# EasyEDA Pro project ProPrj_SmartOvi v1_2025-12-15.epro

# Schematic SmartOvi Circuit
Board Name: Board1; Create Date: 2023-03-04; Page Name: P1; Project Name: SmartOvi v1; Schematic Name: SmartOvi Circuit; Update Date: 2024-11-25; Company: EasyEDA.com; Drawed: EasyEDA Pro; Page Size: A4; Part Number: JLCPCB-002; Reviewed: EasyEDA Pro; Version: V0.1
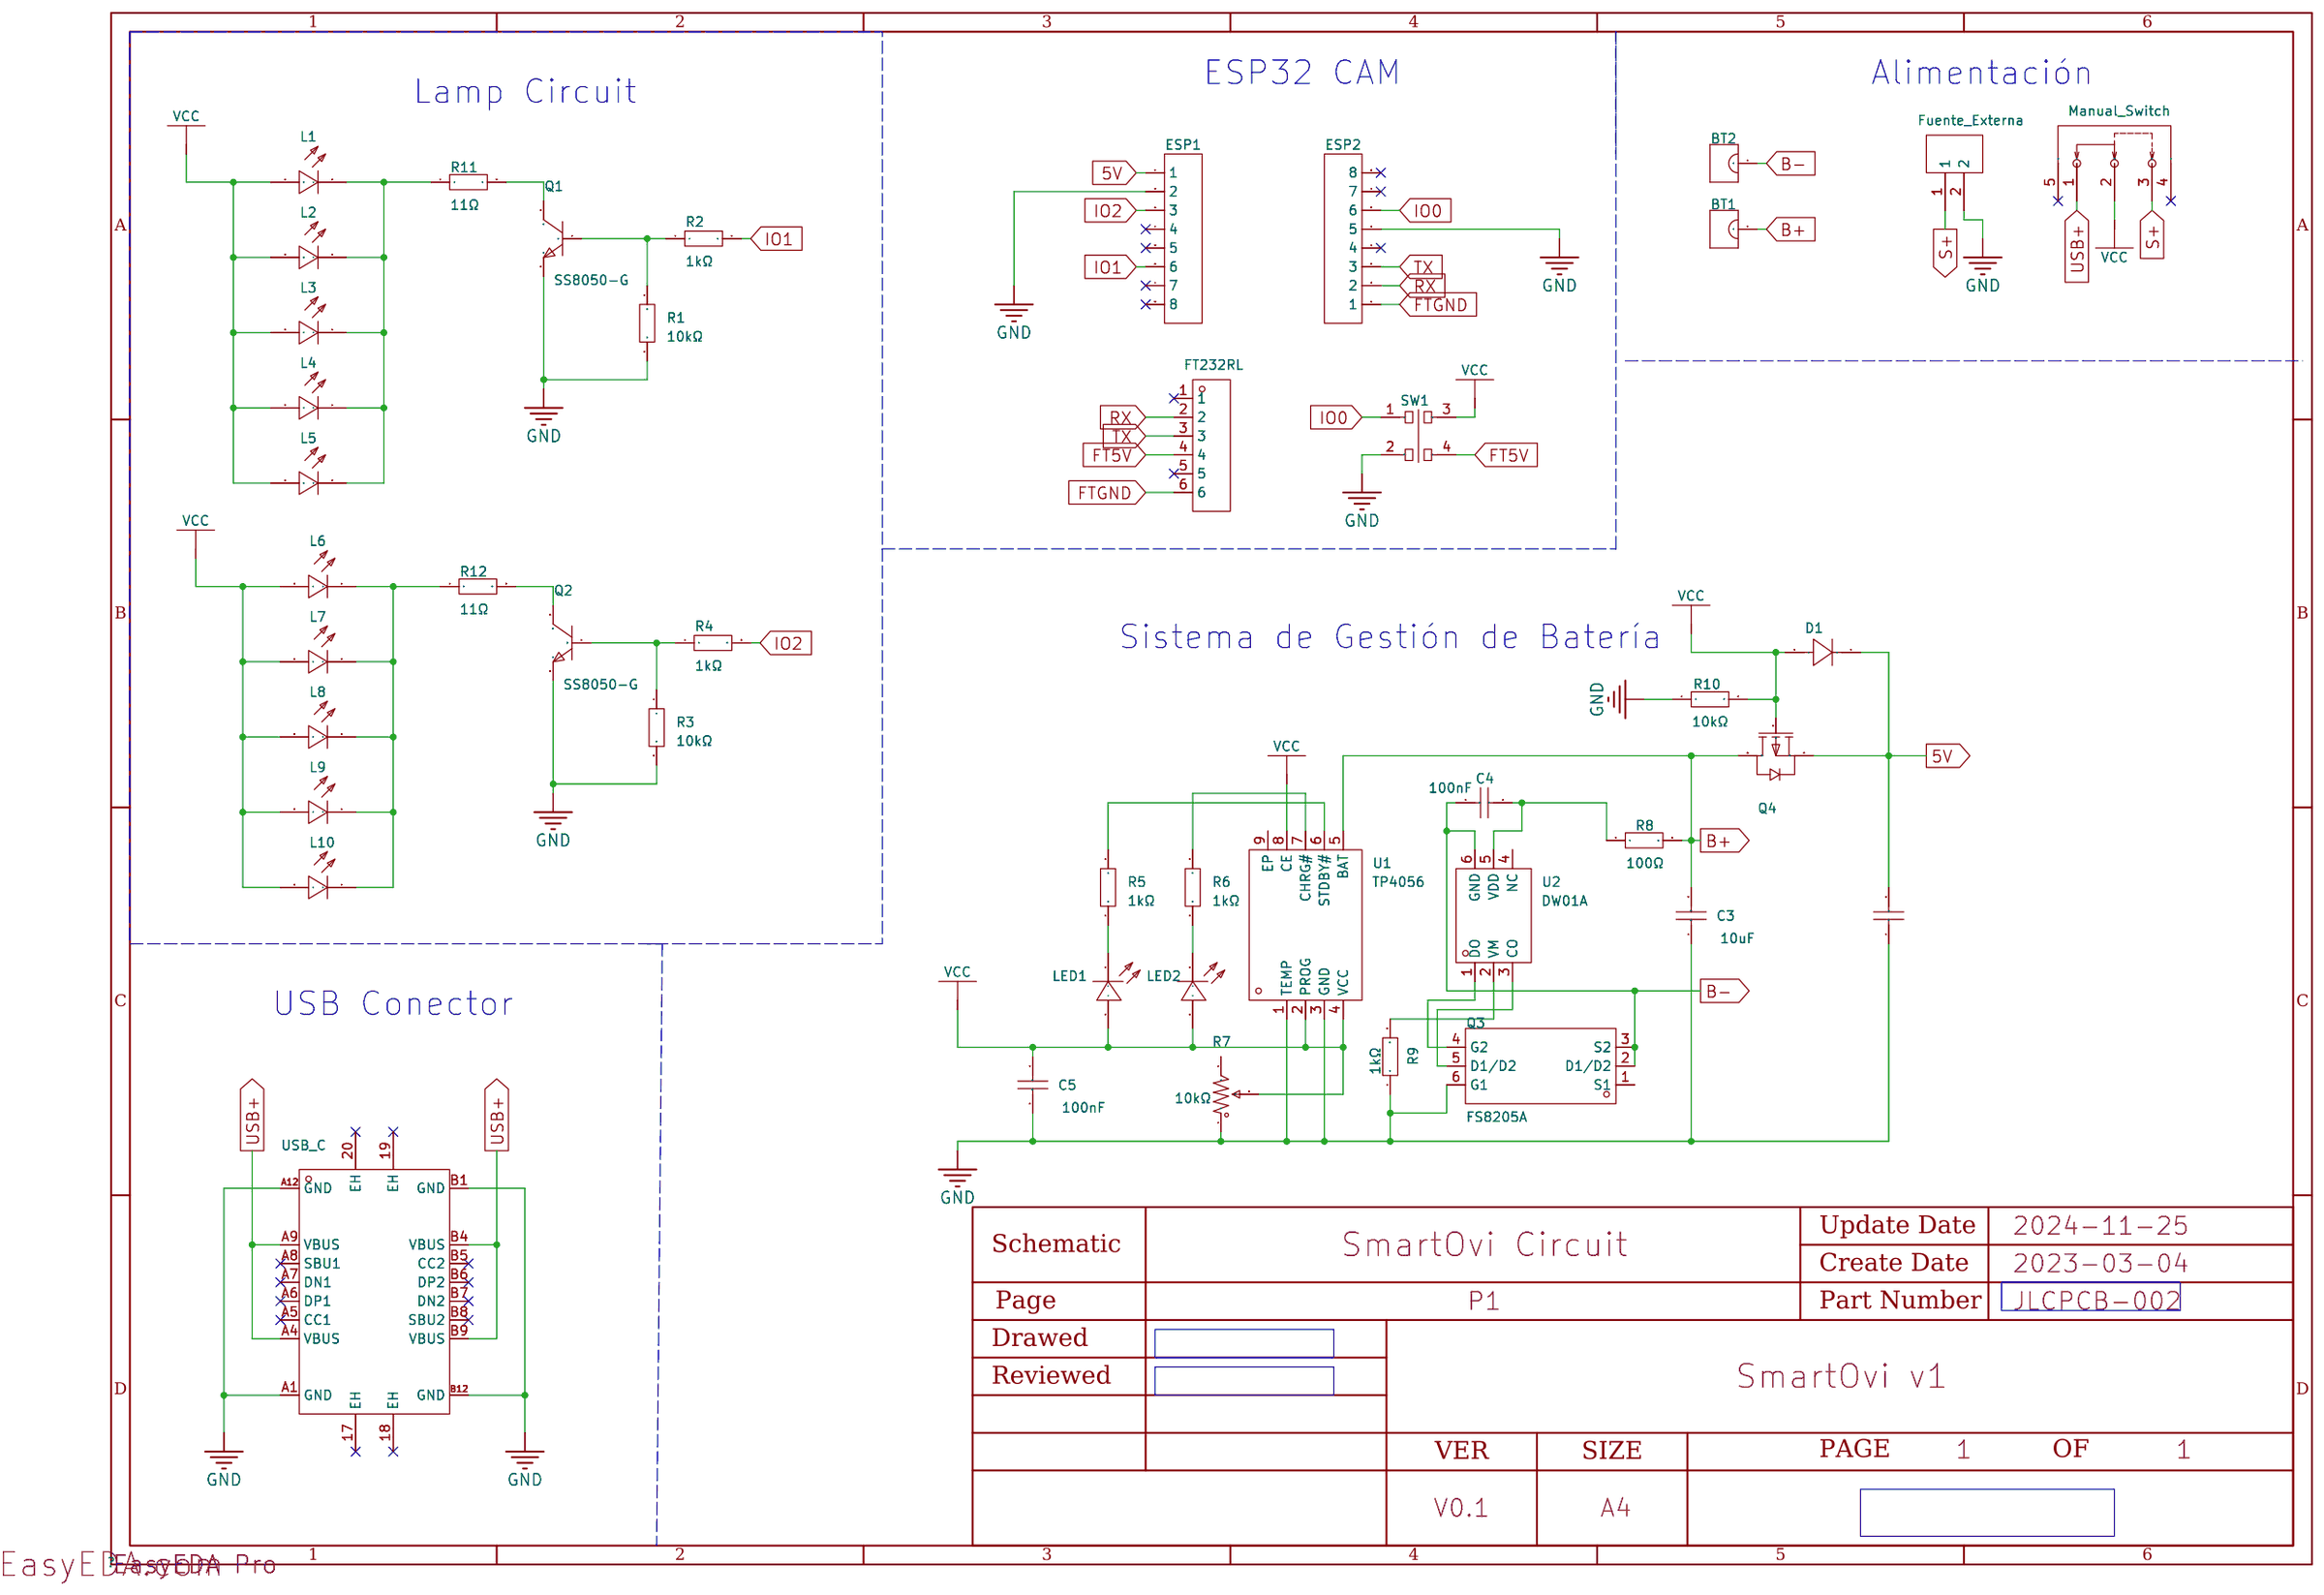
[diagram p0: schematic sheet]

## Parts
BT1  MY-18650-01  [BAT-TH_MY-18650-01]
BT2  MY-18650-01  [BAT-TH_MY-18650-01]
C1  10uF  [C0805]
C3  10uF  [C0805]
C4  100nF  [C0805]
C5  100nF  [C0805]
D1  VS-90EPS16L-M3  [TO-247AD-2_L16.0-W5.0-P10.92-L]
ESP1  2.54-1*8P母环保  [HDR-TH_8P-P2.54-V-F-1]
ESP2  2.54-1*8P母环保  [HDR-TH_8P-P2.54-V-F-1]
FT232RL  2.54-1*6P母  [HDR-TH_6P-P2.54-V-F]
Fuente_Externa  WJ500V-5.08-2P  [CONN-TH_2P-P5.00_WJ500V-5.08-2P]
L1  MHL5013UGDWT  [LED-TH_BD5.8-P2.54-RD]
L2  MHL5013UGDWT  [LED-TH_BD5.8-P2.54-RD]
L3  MHL5013UGDWT  [LED-TH_BD5.8-P2.54-RD]
L4  MHL5013UGDWT  [LED-TH_BD5.8-P2.54-RD]
L5  MHL5013UGDWT  [LED-TH_BD5.8-P2.54-RD]
L6  MHL5013UGDWT  [LED-TH_BD5.8-P2.54-RD]
L7  MHL5013UGDWT  [LED-TH_BD5.8-P2.54-RD]
L8  MHL5013UGDWT  [LED-TH_BD5.8-P2.54-RD]
L9  MHL5013UGDWT  [LED-TH_BD5.8-P2.54-RD]
L10  MHL5013UGDWT  [LED-TH_BD5.8-P2.54-RD]
LED1  NCD0805R1  [LED0805-RD]
LED2  NCD0805B2  [LED0805-RD]
Manual_Switch  SK12D07VG4  [SW-TH_SK12D07VG4]
Q1  SS8050-G  [SOT-23-3_L2.9-W1.6-P1.90-LS2.8-BR]
Q2  SS8050-G  [SOT-23-3_L2.9-W1.6-P1.90-LS2.8-BR]
Q3  FS8205A  [SOT-23-6_L2.9-W1.6-P0.95-LS2.8-BR]
Q4  AO3401A  [SOT-23_L2.9-W1.3-P1.90-LS2.4-BR]
R1  10kΩ  [R0805]
R2  1kΩ  [R0805]
R3  10kΩ  [R0805]
R4  1kΩ  [R0805]
R5  1kΩ  [R0805]
R6  1kΩ  [R0805]
R7  10kΩ  [RES-ADJ-SMD_3P-L3.0-W3.8-P1.75-BR]
R8  100Ω  [R0805]
R9  1kΩ  [R0805]
R10  10kΩ  [R0805]
R11  11Ω  [R0805]
R12  11Ω  [R0805]
SW1  BTSA-L-P-11  [SW-TH_BTSA-X-P-11]
U1  TP4056  [ESOP-8_L4.9-W3.9-P1.27-LS6.0-BL-EP]
U2  DW01A  [SOT-23-6_L2.9-W1.6-P0.95-LS2.8-BL]
USB_C  TYPEC-306DDW-ARP16  [USB-C-TH_TYPEC-306DDW-ARP16]

## Library data of the parts
BT1 BT2 = MY-18650-01: LCSC Part Name: 18650电池夹; Supplier Part: C2979183; Manufacturer: MYOUNG(美阳); Supplier Footprint: 插件; JLCPCB Part Class: Extended Part; Datasheet: https://atta.szlcsc.com/upload/public/pdf/source/20220302/9B78703FC9BDD52215F97855EB9B4A89.pdf; Supplier: LCSC
C1 C3 = CL21A106KPFNNNE: Capacitance: Tolerance:±10% Tolerance:±10% Voltage Rated: Temperature Coefficient:; LCSC Part Name: 10uF ±10% 10V; Supplier Part: C17024; Manufacturer: SAMSUNG(三星); Supplier Footprint: 0805; JLCPCB Part Class: Extended Part; Datasheet: https://atta.szlcsc.com/upload/public/pdf/source/20160103/1457707691379.pdf; Supplier: LCSC; Tolerance: ±10%
C4 C5 = 0805B104K500NT: Capacitance: Tolerance:±10% Tolerance:±10% Voltage Rated: Temperature Coefficient:; LCSC Part Name: 100nF ±10% 50V; Supplier Part: C38141; Manufacturer: FH(风华); Supplier Footprint: 0805; JLCPCB Part Class: Extended Part; Datasheet: https://atta.szlcsc.com/upload/public/pdf/source/20170923/C38141_1506149447419988747.pdf; Supplier: LCSC; Tolerance: ±10%
D1 = VS-90EPS16L-M3: Supplier Part: C468140; Manufacturer: VISHAY(威世); Supplier Footprint: TO-247AD-2L; JLCPCB Part Class: Extended Part; Datasheet: https://atta.szlcsc.com/upload/public/pdf/source/20241025/B94B8A9F71F9BBF4830FCA7478373A93.pdf; Supplier: LCSC
ESP1 ESP2 = 2.54-1*8P母环保: Number of Rows:单排 Number of Holes:8 Pitch:2.54mm Holes Structure:1x8P Row Spacing:- Mounting Type:Straight Insulation Height:- Contact Material:- Contact Plating:-; LCSC Part Name: 2.54mm 1x8P; Supplier Part: C27438; Manufacturer: BOOMELE(博穆精密); Supplier Footprint: 插件,P=2.54mm; JLCPCB Part Class: Extended Part; Datasheet: https://atta.szlcsc.com/upload/public/pdf/source/20151109/1457707554453.pdf; Supplier: LCSC; Number of Rows: 单排; Number of Holes: 8; Pitch: 2.54mm; Holes Structure: 1x8P; Mounting Type: Straight
FT232RL = 2.54-1*6P母: Number of Rows:单排 Number of Holes:6 Pitch:2.54mm Holes Structure:1x6P Row Spacing:- Mounting Type:Straight Insulation Height:- Contact Material:- Contact Plating:-; LCSC Part Name: 2.54mm 1x6P; Supplier Part: C40877; Manufacturer: BOOMELE(博穆精密); Supplier Footprint: 直插,P=2.54mm; JLCPCB Part Class: Extended Part; Datasheet: https://atta.szlcsc.com/upload/public/pdf/source/20151109/1457707559772.pdf; Supplier: LCSC; Number of Rows: 单排; Number of Holes: 6; Pitch: 2.54mm; Holes Structure: 1x6P; Mounting Type: Straight
Fuente_Externa = WJ500V-5.08-2P: Pitch:5.08mm Number of Rows:1 Number of PINs Per Row:2 Mounting Style:直针 Current Rating (Max):18A Voltage Rating (Max):250V Wire Gauge - AWG:14~30 Wire Gauge - mm?:2.5 Operating Temperature Range:-40℃~+105℃ Operating Temperature Range:-40℃~+105℃ Color:Gre; LCSC Part Name: 5.08mm 排数:1 每排P数:2 直针 可拼接; Supplier Part: C8465; Manufacturer: KANGNEX(康奈克斯电气); Supplier Footprint: 直插,P=5.08mm; JLCPCB Part Class: Extended Part; Datasheet: https://atta.szlcsc.com/upload/public/pdf/source/20191225/C8465_02D34CE5B5B4A53DF5891601D97FA9F4.pdf; Supplier: LCSC; Pitch: 5.08mm; Number of Rows: 1; Number of PINs Per Row: 2; Mounting Style: 直针; Current Rating (Max): 18A; Voltage Rating (Max): 250V; Wire Gauge - AWG: 14~30; Wire Gauge - mm?: 2.5; Operating Temperature Range: -40℃~+105℃; Color: Green
L1-L10 = MHL5013UGDWT: Emitted Color:Emerald Diode Configuration:- Lens Color:White Diffused Dominant Wavelength:520nm~530nm Dominant Wavelength:520nm~530nm Peak Wavelength:525nm Color Temperature:- Color Temperature:- Forward Current:20mA Power Dissipation:120mW Viewing Angle:; LCSC Part Name: 翠绿 520nm; Supplier Part: C417346; Manufacturer: MEIHUA(美华); Supplier Footprint: 直插,P=2.54mm; JLCPCB Part Class: Extended Part; Datasheet: https://atta.szlcsc.com/upload/public/pdf/source/20190909/C417346_9C6EDD89A9CF248C5D5080F68B9C965C.pdf; Supplier: LCSC; Emitted Color: Emerald; Lens Color: White Diffused; Dominant Wavelength: 520nm~530nm; Peak Wavelength: 525nm; Forward Current: 20mA; Power Dissipation: 120mW; Viewing Angle: 40°; Operating Temperature: -25℃~+85℃; Lamp Holder Type: 5mm圆形灯头
LED1 = NCD0805R1_C84256: Emitted Color:红灯; LCSC Part Name: 红灯; Supplier Part: C84256; Manufacturer: 国星光电; Supplier Footprint: 0805; JLCPCB Part Class: Basic Part; Datasheet: https://atta.szlcsc.com/upload/public/pdf/source/20200820/C84256_F0A75A43B3EAD75808600A0514C76B99.pdf; Supplier: LCSC; Emitted Color: 红灯
LED2 = NCD0805B2: Emitted Color:blue; LCSC Part Name: 蓝灯; Supplier Part: C84259; Manufacturer: 国星光电; Supplier Footprint: 0805; JLCPCB Part Class: Extended Part; Datasheet: https://atta.szlcsc.com/upload/public/pdf/source/20200820/C84259_E5AC6865415989C4C2C2831134BA3A23.pdf; Supplier: LCSC; Emitted Color: blue
Manual_Switch = SK12D07VG4: Operating Force: Contact Material: Rated Voltage(DC): Contact Rating @ Voltage: Contact Finish:- Operating Temperature: Circuit: Electrical Life Cycles: Rated Voltage(AC):- Mounting Type: Switch Function: Switch Height: Actuator Orientation:Horizontal Con; LCSC Part Name: 3脚2二档位SK12D07VG4滑动开关1P2T卧式拨动开关; Supplier Part: C393937; Manufacturer: SHOU HAN(首韩); Supplier Footprint: 插件,P=2mm; JLCPCB Part Class: Extended Part; Datasheet: https://atta.szlcsc.com/upload/public/pdf/source/20190521/C393937_939FE26E571CC67D2D532E953108A1B0.pdf; Supplier: LCSC; Actuator Orientation: Horizontal
Q1 Q2 = SS8050-G_C164886: Transistor Type: Collector-Emitter Breakdown Voltage (Vceo): Collector Current (Ic): Power Dissipation (Pd): Collector Cut-Off Current (Icbo):100nA Collector-Emitter Saturation Voltage (VCE(sat)@Ic,Ib):500mV@800mA,80mA DC Current Gain (hFE@Ic,Vce):120@100; LCSC Part Name: NPN 25V 1.5A L档(120-200); Supplier Part: C164886; Manufacturer: CJ(江苏长电/长晶); Supplier Footprint: SOT-23; JLCPCB Part Class: Extended Part; Datasheet: https://atta.szlcsc.com/upload/public/pdf/source/20171228/C164886_15144412883891213890.pdf; Supplier: LCSC; Collector Cut-Off Current (Icbo): 100nA; Collector-Emitter Saturation Voltage (VCE(sat)@Ic,Ib): 500mV@800mA,80mA; DC Current Gain (hFE@Ic,Vce): 120@100mA,1V; Transition Frequency (fT): 100MHz; Operating Temperature: +150℃@(Tj)
Q3 = FS8205A_C908265: Type:2 N-Channel Drain Source Voltage (Vdss): Continuous Drain Current (Id): Power Dissipation (Pd): Drain Source On Resistance (RDS(on)@Vgs,Id):18mΩ@4.5V,6A Gate Threshold Voltage (Vgs(th)@Id):1.2V@250uA Total Gate Charge (Qg@Vgs):11nC@4.5V Input Capacit; LCSC Part Name: 2个N沟道 20V 6A; Supplier Part: C908265; Manufacturer: FUXINSEMI(富芯森美); Supplier Footprint: SOT-23-6; JLCPCB Part Class: Extended Part; Datasheet: https://atta.szlcsc.com/upload/public/pdf/source/20201027/C908265_C6F1A5E0FB14735EF799FEF607A99450.pdf; Supplier: LCSC; Type: 2 N-Channel; Drain Source On Resistance (RDS(on)@Vgs,Id): 18mΩ@4.5V,6A; Gate Threshold Voltage (Vgs(th)@Id): 1.2V@250uA; Total Gate Charge (Qg@Vgs): 11nC@4.5V; Input Capacitance (Ciss@Vds): 800pF@8V; Reverse Transfer Capacitance (Crss@Vds): 125pF@8V; Operating Temperature: -55℃~+150℃@(Tj)
Q4 = AO3401A_C347476: Supplier Part: C347476; Manufacturer: UMW(广东友台半导体); Supplier Footprint: SOT-23; JLCPCB Part Class: Extended Part; Datasheet: https://atta.szlcsc.com/upload/public/pdf/source/20190827/C347476_6CCC01FEC3E3D166C83BA0E415FD2056.pdf; Supplier: LCSC
R1 R3 R10 = 0805W8J0103T5E: Type:Thick Film Resistors Resistance: Tolerance:±5% Tolerance:±5% Power(Watts): Temperature Coefficient:±100ppm/℃ Temperature Coefficient:±100ppm/℃ Overload Voltage (Max): Operating Temperature Range:-55℃~+155℃ Operating Temperature Range:-55℃~+155℃; LCSC Part Name: 10kΩ ±5% 125mW; Supplier Part: C25612; Manufacturer: UNI-ROYAL(厚声); Supplier Footprint: 0805; JLCPCB Part Class: Extended Part; Datasheet: https://atta.szlcsc.com/upload/public/pdf/source/20200306/C422600_1E6D84923E4A46A82E41ADD87F860B5C.pdf; Supplier: LCSC; Type: Thick Film Resistors; Tolerance: ±5%; Temperature Coefficient: ±100ppm/℃; Operating Temperature Range: -55℃~+155℃
R2 R4-R6 R9 = 0805W8J0102T5E: Type:Thick Film Resistors Resistance: Tolerance:±5% Tolerance:±5% Power(Watts): Temperature Coefficient:±100ppm/℃ Temperature Coefficient:±100ppm/℃ Overload Voltage (Max): Operating Temperature Range:-55℃~+155℃ Operating Temperature Range:-55℃~+155℃; LCSC Part Name: 1kΩ ±5% 125mW; Supplier Part: C25623; Manufacturer: UNI-ROYAL(厚声); Supplier Footprint: 0805; JLCPCB Part Class: Extended Part; Datasheet: https://atta.szlcsc.com/upload/public/pdf/source/20200306/C422600_1E6D84923E4A46A82E41ADD87F860B5C.pdf; Supplier: LCSC; Type: Thick Film Resistors; Tolerance: ±5%; Temperature Coefficient: ±100ppm/℃; Operating Temperature Range: -55℃~+155℃
R7 = TC33X-2-103E: Resistance: Tolerance:±25% Tolerance:±25% Power(Watts):150mW Turns:- Rated Voltage:-; LCSC Part Name: 10kΩ ±25%; Supplier Part: C719176; Manufacturer: BOURNS; Supplier Footprint: SMD; JLCPCB Part Class: Extended Part; Datasheet: https://atta.szlcsc.com/upload/public/pdf/source/20200810/C720646_BB66A75E654D5E1D30127FF45BCD3C26.pdf; Supplier: LCSC; Tolerance: ±25%; Power(Watts): 150mW
R8 = RTT05101JTP: Type:Thick Film Resistors Resistance: Tolerance:±5% Tolerance:±5% Power(Watts): Temperature Coefficient:±100ppm/℃ Temperature Coefficient:±100ppm/℃ Overload Voltage (Max): Operating Temperature Range:-55℃~+155℃ Operating Temperature Range:-55℃~+155℃; LCSC Part Name: 100Ω ±5% 125mW; Supplier Part: C103909; Manufacturer: RALEC(旺诠); Supplier Footprint: 0805; JLCPCB Part Class: Extended Part; Datasheet: https://atta.szlcsc.com/upload/public/pdf/source/20170408/1491646391529.pdf; Supplier: LCSC; Type: Thick Film Resistors; Tolerance: ±5%; Temperature Coefficient: ±100ppm/℃; Operating Temperature Range: -55℃~+155℃
R11 R12 = AECR0805F11R0K9: Type:Thick Film Resistors Resistance: Tolerance:±1% Tolerance:±1% Power(Watts): Overload Voltage (Max): Temperature Coefficient:±100ppm/℃ Temperature Coefficient:±100ppm/℃ Operating Temperature Range:-55℃~+155℃ Operating Temperature Range:-55℃~+155℃; LCSC Part Name: 厚膜电阻 11Ω ±1% 125mW; Supplier Part: C352275; Manufacturer: RESI(开步睿思); Supplier Footprint: 0805; JLCPCB Part Class: Extended Part; Datasheet: https://atta.szlcsc.com/upload/public/pdf/source/20181212/C352486_55819DC58ECB15BFA3B0F11121E3606D.pdf; Supplier: LCSC; Type: Thick Film Resistors; Tolerance: ±1%; Temperature Coefficient: ±100ppm/℃; Operating Temperature Range: -55℃~+155℃
SW1 = BTSA-L-P-11: Contact Current:100mA Insulation Resistance:100MΩ Mounting Style:立插 Self Lock / No Lock:LATCHING Actuator Style:方型按钮 Actuator/Cap Color:Blue With Lamp:No Pin Style:PCPin Operating Force:250gf@±50gf Operating Temperature:-20℃~+70℃ Operating Temperature:-20; LCSC Part Name: 按键开关; Supplier Part: C2693635; Manufacturer: ROCPU Switches(台普); Supplier Footprint: 插件; JLCPCB Part Class: Extended Part; Datasheet: https://atta.szlcsc.com/upload/public/pdf/source/20210317/C2693625_B3D83B78D2512AD179A7F987F25D7A8F.pdf; Supplier: LCSC; Contact Current: 100mA; Insulation Resistance: 100MΩ; Mounting Style: 立插; Self Lock / No Lock: LATCHING; Actuator Style: 方型按钮; Actuator/Cap Color: Blue; With Lamp: No; Pin Style: PCPin; Operating Force: 250gf@±50gf; Operating Temperature: -20℃~+70℃; Mechanical Life: 10000
U1 = TP4056_C5311018: Supplier Part: C5311018; Manufacturer: TECH PUBLIC(台舟); Supplier Footprint: SOP8; JLCPCB Part Class: Extended Part; Datasheet: https://atta.szlcsc.com/upload/public/pdf/source/20221212/0F3B9F9266E4757C9709D8C4E35AA47D.pdf; Supplier: LCSC
U2 = DW01A_C436931: Supplier Part: C436931; Manufacturer: TF(拓锋); Supplier Footprint: SOT-23-6; JLCPCB Part Class: Extended Part; Datasheet: https://atta.szlcsc.com/upload/public/pdf/source/20191121/C436931_2F3233FCEFFE76204A0A035C9B3278D6.pdf; Supplier: LCSC
USB_C = TYPEC-306DDW-ARP16: Connector Type:Type-C Standard:USB 3.1 Gender:Female Number of Contacts:16 Number of Ports:1 Mounting Style:Shrouded Current Rating - Power (Max):5A Contact Material:- Contact Plating:- Operating Temperature Range:-45℃~+85℃ Operating Temperature Range:-45; LCSC Part Name: Type-C 母座 弯插; Supplier Part: C2840393; Manufacturer: XUNPU(讯普); Supplier Footprint: 插件,9.69x8.97x2.56mm; JLCPCB Part Class: Extended Part; Datasheet: https://atta.szlcsc.com/upload/public/pdf/source/20210817/197D5097245422051F6928F5184DB483.pdf; Supplier: LCSC; Connector Type: Type-C; Standard: USB 3.1; Gender: Female; Number of Contacts: 16; Number of Ports: 1; Mounting Style: Shrouded; Current Rating - Power (Max): 5A; Operating Temperature Range: -45℃~+85℃; Welding Temperature (Max): 260℃

## Nets
5V: C1.2 D1.1(K) ESP1.1 Q4.2(S)
GND: C1.1 C3.1 C5.2 ESP1.2 ESP2.5 Fuente_Externa.2 Q1.2(E) Q2.2(E) Q3.6(G1) R1.2 R3.2 R7.1 R9.1 R10.1 SW1.2 U1.1(TEMP) U1.3(GND) USB_C.A1(GND) USB_C.A12(GND) USB_C.B1(GND) USB_C.B12(GND)
VCC: C5.1 D1.3(A) L1.2(A) L2.2(A) L3.2(A) L4.2(A) L5.2(A) L6.2(A) L7.2(A) L8.2(A) L9.2(A) L10.2(A) LED1.2(+) LED2.2(+) Manual_Switch.2 Q4.1(G) R7.2 R10.2 SW1.3 U1.2(PROG) U1.4(VCC) U1.8(CE)
B+: BT1.1 C3.2 Q4.3(D) R8.2 U1.5(BAT)
B-: BT2.1 C4.1 Q3.2(D1/D2) Q3.3(S2) U2.6(GND)
FT5V: FT232RL.4 SW1.4
FTGND: ESP2.1 FT232RL.6
IO0: ESP2.6 SW1.1
IO1: ESP1.6 R2.2
IO2: ESP1.3 R4.2
RX: ESP2.2 FT232RL.2
S+: Fuente_Externa.1 Manual_Switch.3
TX: ESP2.3 FT232RL.3
USB+: Manual_Switch.1 USB_C.A4(VBUS) USB_C.A9(VBUS) USB_C.B4(VBUS) USB_C.B9(VBUS)
$1N1189: Q1.1(B) R1.1 R2.1
$1N3696: Q2.1(B) R3.1 R4.1
$1N13989: LED1.1(-) R5.1
$1N14047: LED2.1(-) R6.1
$1N15255: R6.2 U1.7(CHRG#)
$1N15286: R5.2 U1.6(STDBY#)
$1N20138: C4.2 R8.1 U2.5(VDD)
$1N20626: Q3.4(G2) U2.1(DO)
$1N20664: Q3.5(D1/D2) U2.3(CO)
$1N21805: R9.2 U2.2(VM)
Net-(L1-1): L1.1(K) L2.1(K) L3.1(K) L4.1(K) L5.1(K) R11.1
Net-(L6-1): L6.1(K) L7.1(K) L8.1(K) L9.1(K) L10.1(K) R12.1
Net-(Q1-3): Q1.3(C) R11.2
Net-(Q2-3): Q2.3(C) R12.2

Not connected (* = marked no-connect by the designer): ESP1 4* 5* 7* 8*; ESP2 4* 7* 8*; FT232RL 1* 5*; Manual_Switch 4* 5*; Q3 1(S1); R7 3; U1 9(EP); U2 4(NC); USB_C 17(EH)* 18(EH)* 19(EH)* 20(EH)* A5(CC1)* A6(DP1)* A7(DN1)* A8(SBU1)* B5(CC2)* B6(DP2)* B7(DN2)* B8(SBU2)*

## Notes on the sheet
- ESP32 CAM
- Alimentación
- Lamp Circuit
- Sistema de Gestión de Batería
- USB Conector

# Board SmartOviPCB
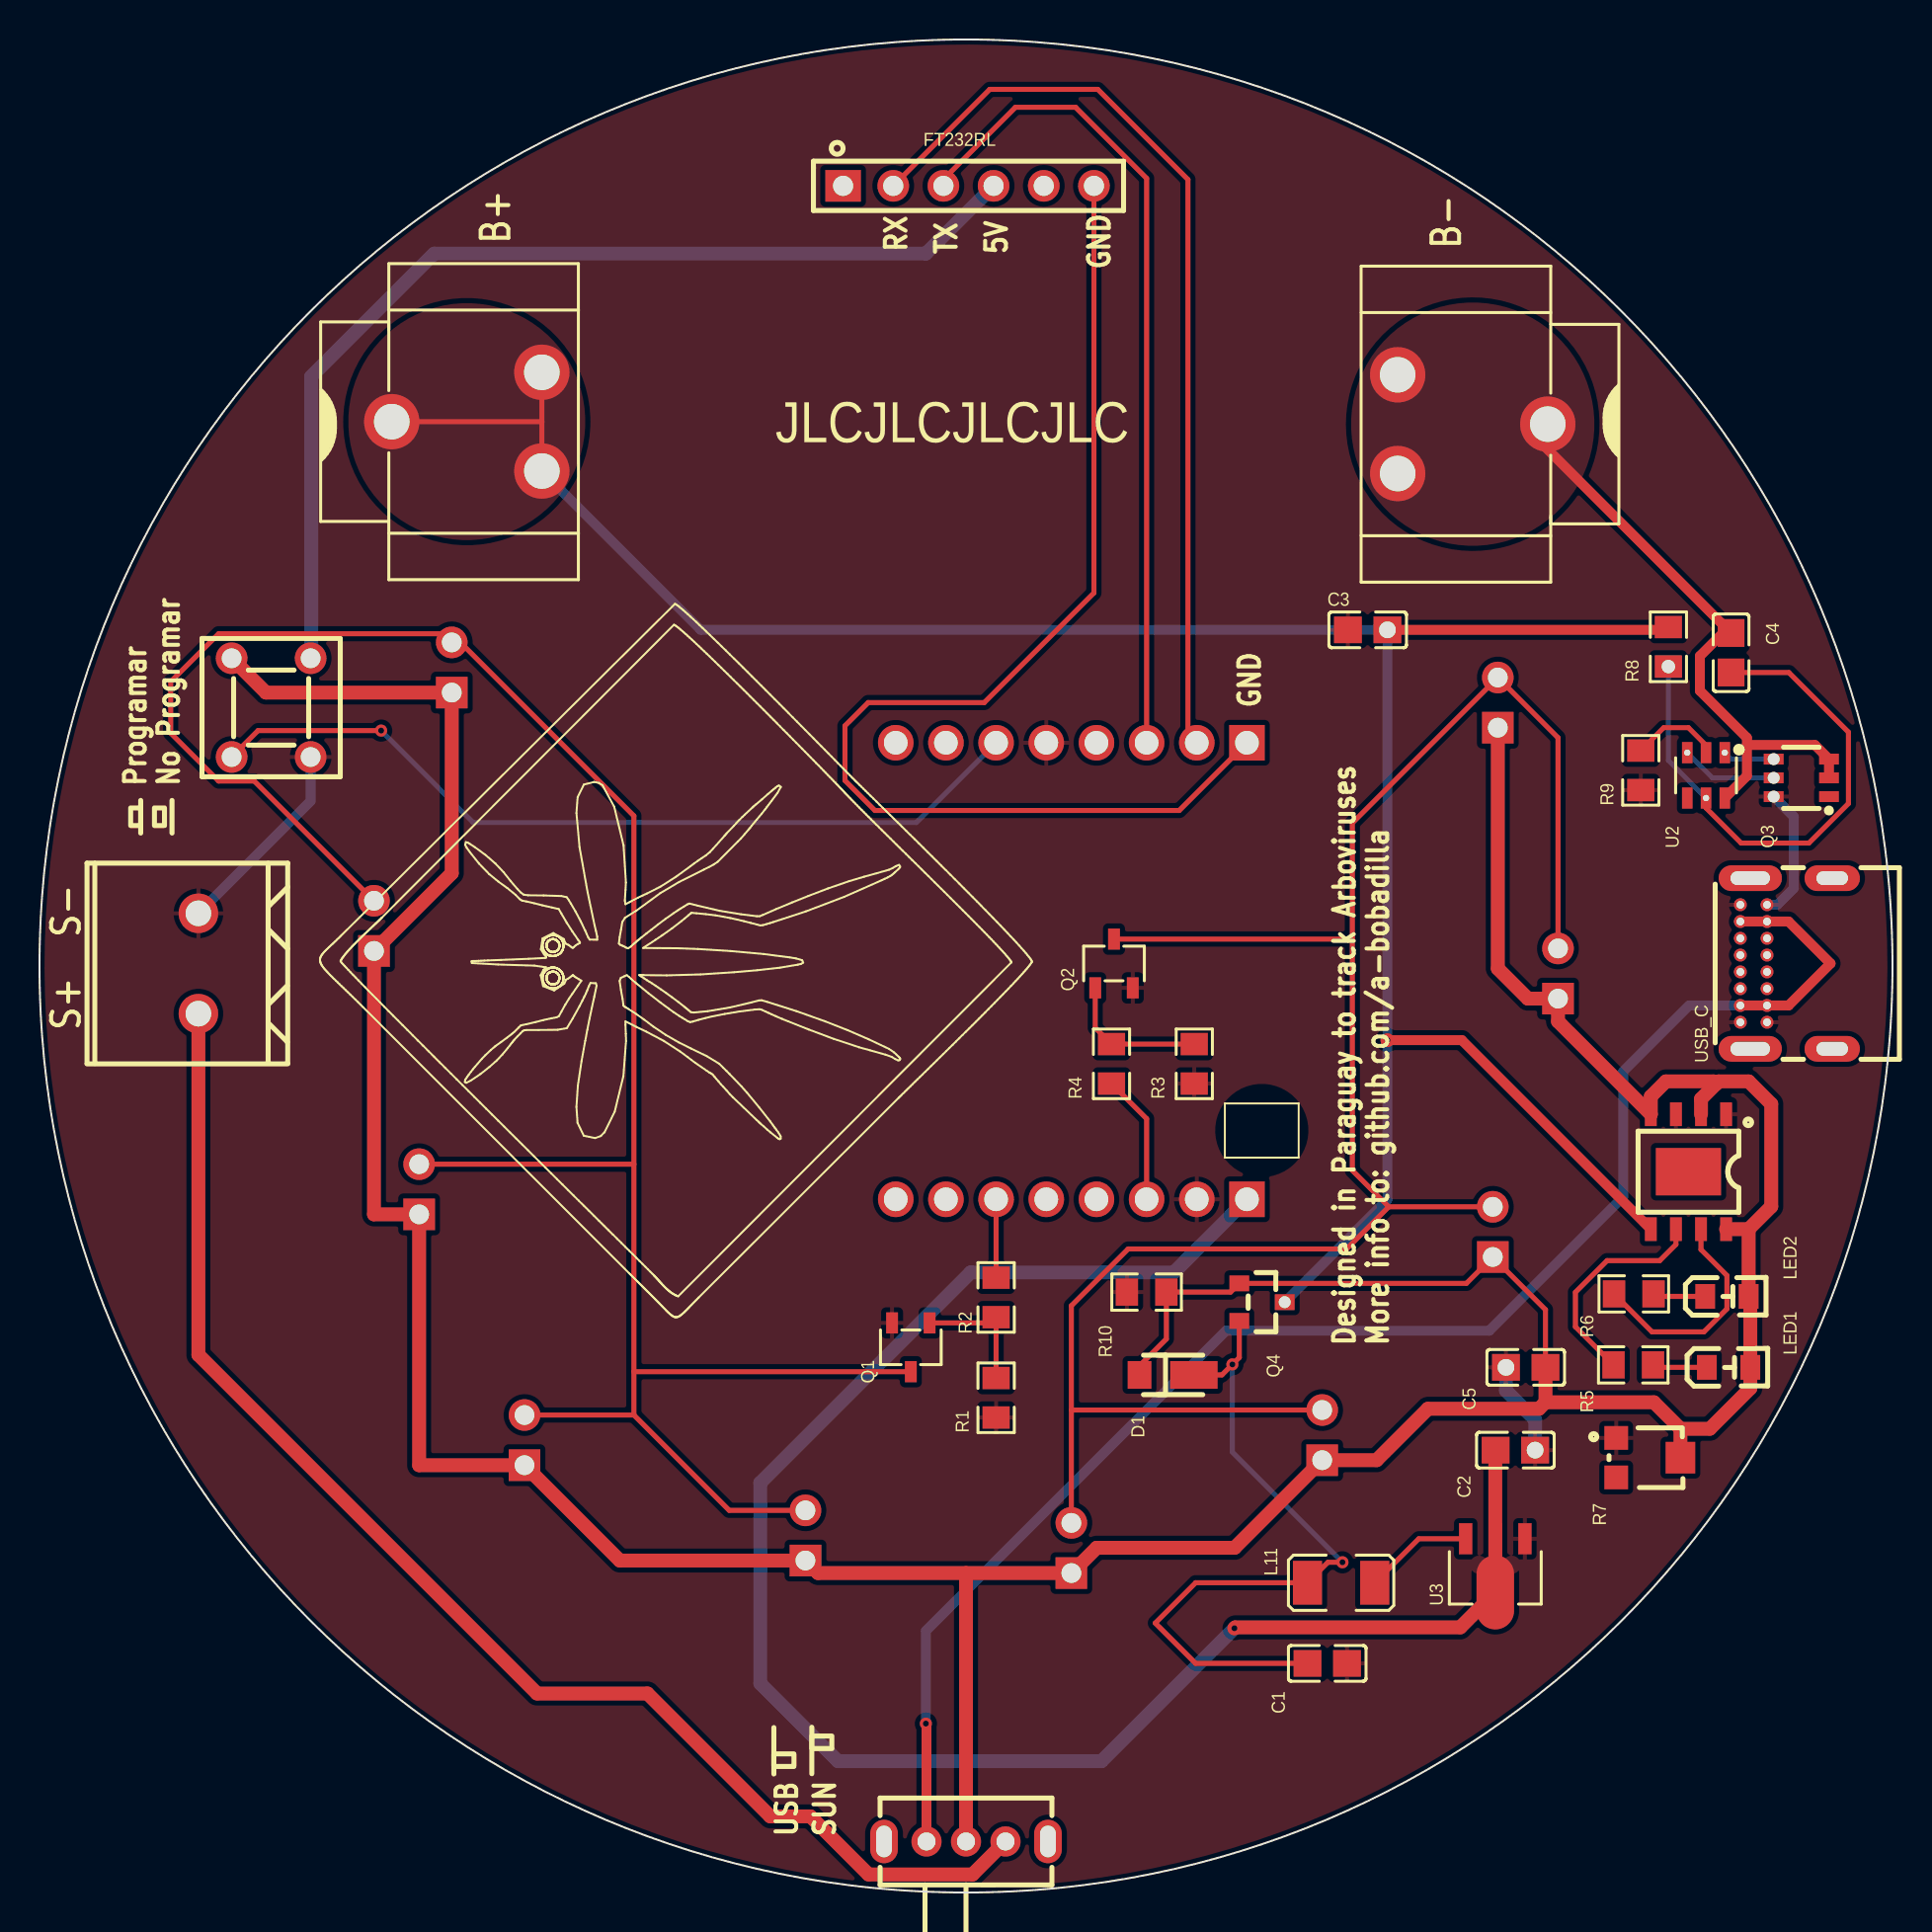
[diagram p1: board, top side]
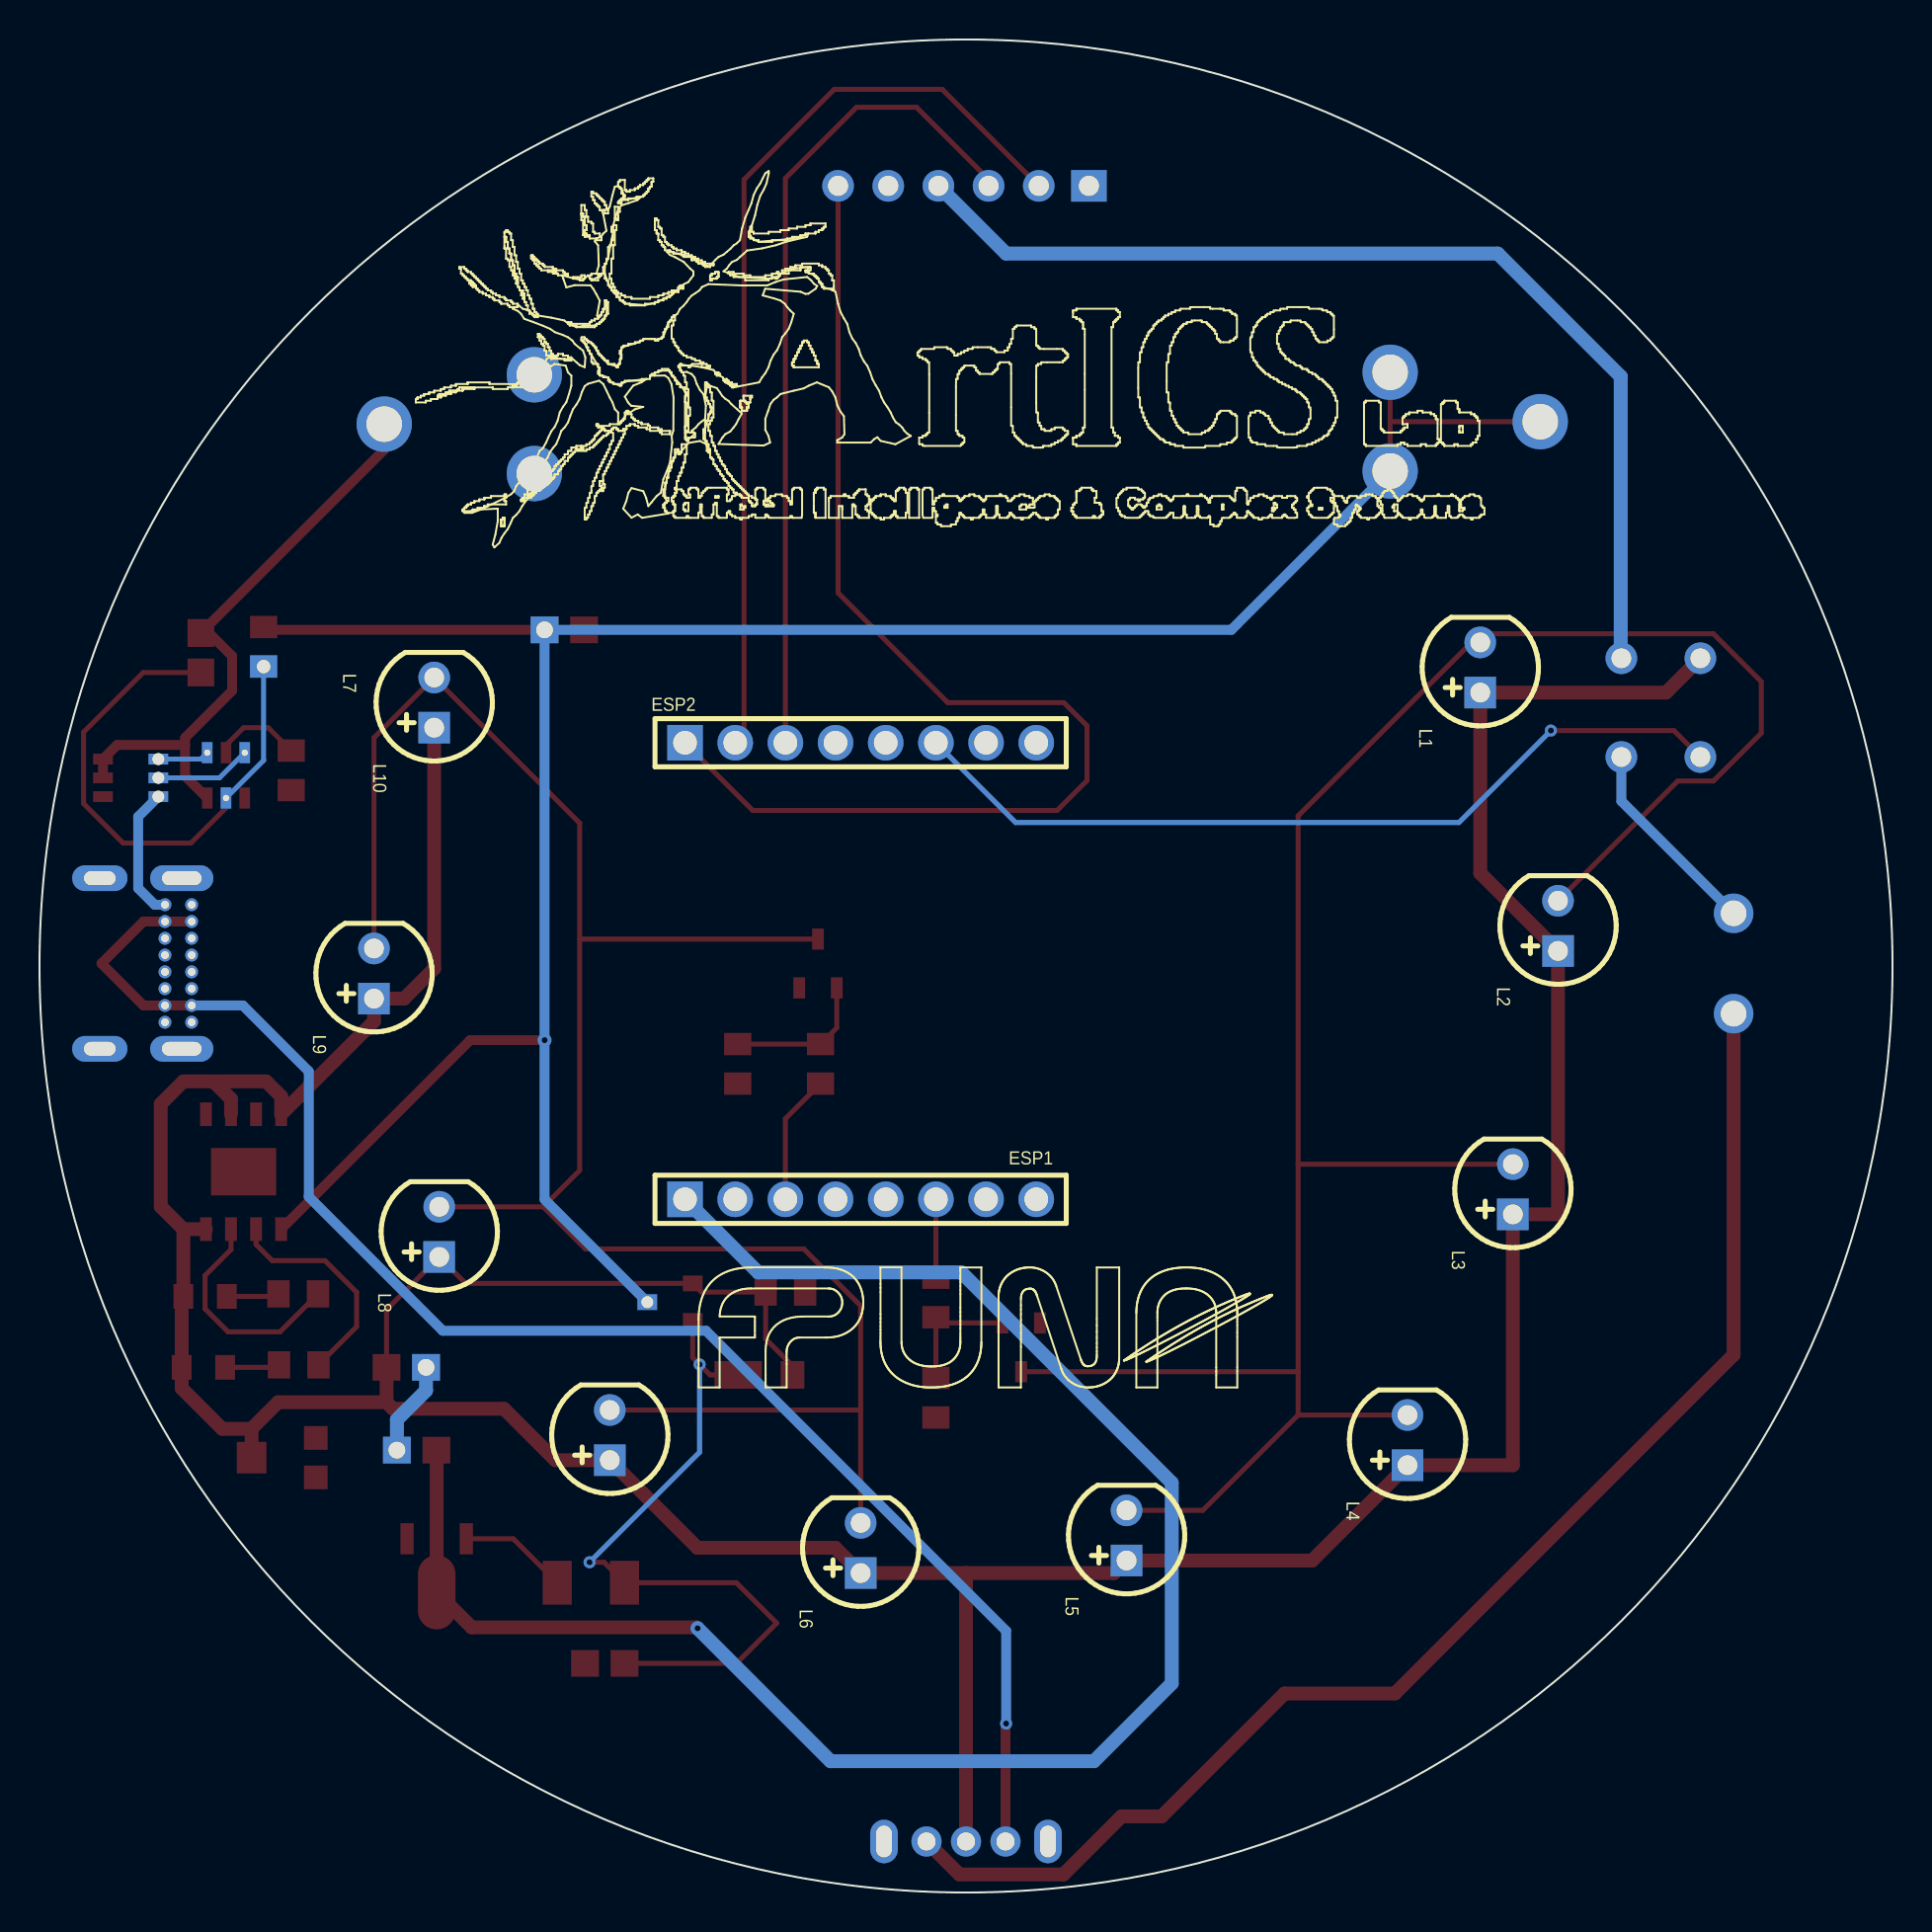
[diagram p2: board, bottom side, seen from below]

Outline 93.81 x 93.81 mm; copper layers: Top Layer, Bottom Layer. Coordinates in mm from the lower left corner of the outline.
Outline path: circle c46.91,46.91 r46.91
Stack: Top Layer 0.035mm / Dielectric1 0.71mm FR4 er 4.5 / Bottom Layer 0.035mm

## Design rules (mm)
spacing safeClearance (default): track to track 0.152, other pairs 0.152 to 0.3
track width trackWidth (default): min 0.127, default 0.254, max 2.54
differential pair differentialPair (default): width min 0.127, default 0.254, max 2.54; gap min 0.152, default 0.152
via viaSize (default): diameter min 0.5, default 0.61, max 10; hole min 0.3, default 0.305, max 6

## Placement (name value [footprint] x y rotation side)
BT1  MY-18650-01  [BAT-TH_MY-18650-01]  21.63 74.47 0 top
BT2  MY-18650-01  [BAT-TH_MY-18650-01]  72.56 74.34 180 top
C1  10uF  [C0805]  65.19 11.6 180 top
C2  -  [C0805]  74.72 22.4 180 top
C3  10uF  [C0805]  67.24 63.92 0 top
C4  100nF  [C0805]  85.64 62.77 270 top
C5  100nF  [C0805]  75.24 26.59 180 top
D1  VS-90EPS16L-M3  [POWERDI123_L2.8-W1.8-LS3.7-RD]  57.07 26.21 180 top
ESP1  2.54-1*8P母环保  [HDR-TH_8P-P2.54-V-F-1]  52.24 35.1 180 bottom
ESP2  2.54-1*8P母环保  [HDR-TH_8P-P2.54-V-F-1]  52.24 58.21 180 bottom
FT232RL  2.54-1*6P母  [HDR-TH_6P-P2.54-V-F]  47.03 86.4 0 top
L1  MHL5013UGDWT  [LED-TH_BD5.8-P2.54-RD]  20.87 62.02 90 bottom
L2  MHL5013UGDWT  [LED-TH_BD5.8-P2.54-RD]  16.93 48.94 90 bottom
L3  MHL5013UGDWT  [LED-TH_BD5.8-P2.54-RD]  19.22 35.6 90 bottom
L4  MHL5013UGDWT  [LED-TH_BD5.8-P2.54-RD]  24.55 22.9 90 bottom
L5  MHL5013UGDWT  [LED-TH_BD5.8-P2.54-RD]  38.78 18.08 90 bottom
L6  MHL5013UGDWT  [LED-TH_BD5.8-P2.54-RD]  52.24 17.44 90 bottom
L7  MHL5013UGDWT  [LED-TH_BD5.8-P2.54-RD]  64.94 23.16 90 bottom
L8  MHL5013UGDWT  [LED-TH_BD5.8-P2.54-RD]  73.58 33.44 90 bottom
L9  MHL5013UGDWT  [LED-TH_BD5.8-P2.54-RD]  76.88 46.53 90 bottom
L10  MHL5013UGDWT  [LED-TH_BD5.8-P2.54-RD]  73.83 60.24 90 bottom
L11  -  [L1210]  65.9 15.68 0 top
LED1  NCD0805R1  [LED0805-RD]  85.51 26.59 0 top
LED2  NCD0805B2  [LED0805-RD]  85.43 30.18 0 top
Q1  SS8050-G  [SOT-23-3_L2.9-W1.6-P1.90-LS2.8-BR]  44.11 27.6 90 top
Q2  SS8050-G  [SOT-23-3_L2.9-W1.6-P1.90-LS2.8-BR]  54.4 47.03 270 top
Q3  FS8205A  [SOT-23-6_L2.9-W1.6-P0.95-LS2.8-BR]  89.2 56.43 0 top
Q4  AO3401A  [SOT-23_L2.9-W1.3-P1.90-LS2.4-BR]  61.89 29.89 180 top
R1  10kΩ  [R0805]  48.43 25.05 270 top
R2  1kΩ  [R0805]  48.43 30.13 90 top
R3  10kΩ  [R0805]  58.46 41.95 270 top
R4  1kΩ  [R0805]  54.27 41.95 270 top
R5  1kΩ  [R0805]  80.69 26.71 180 top
R6  1kΩ  [R0805]  80.71 30.31 180 top
R7  10kΩ  [RES-ADJ-SMD_3P-L3.0-W3.8-P1.75-BR]  81.45 22.01 180 top
R8  100Ω  [R0805]  82.47 63.07 90 top
R9  1kΩ  [R0805]  81.07 56.81 90 top
R10  10kΩ  [R0805]  56.05 30.4 0 top
SOLAR_PIN  -  [CONN-TH_2P-P5.00_WJ500V-5.08-2P]  8.04 47.03 90 top
SOURCE_SW  -  [SW-TH_SK12D07VG4]  46.91 2.58 0 top
SW1  BTSA-L-P-11  [SW-TH_BTSA-X-P-11]  11.73 59.99 90 top
U1  TP4056  [ESOP-8_L4.9-W3.9-P1.27-LS6.0-BL-EP]  83.48 36.49 180 top
U2  DW01A  [SOT-23-6_L2.9-W1.6-P0.95-LS2.8-BL]  84.37 56.56 180 top
U3  -  [SOT-89-3_L4.5-W2.5-P1.50-LS4.2-BR]  73.7 16.55 90 top
USB_C  TYPEC-306DDW-ARP16  [USB-C-TH_TYPEC-306DDW-ARP16]  88.44 47.03 90 top

## Footprints (pads in the part's own frame, mm; a bottom-side part is the same pattern mirrored in y, then rotated)
BAT-TH_MY-18650-01
  round 2.8 hole 1.8: 1(-3.8,-0.001) 1(3.799,2.5) 1(3.8,-2.5)
C0805
  rect 1.41x1.35 hole 0.846: 1(-1,0)
  rect 1.41x1.35 smd: 2(1,0)
CONN-TH_2P-P5.00_WJ500V-5.08-2P
  round 2 hole 1.3: 1(-2.54,0) 2(2.54,0)
ESOP-8_L4.9-W3.9-P1.27-LS6.0-BL-EP
  rect 0.6x1.2 smd: 1(-1.905,-2.909) 2(-0.635,-2.909) 3(0.635,-2.909) 4(1.905,-2.909) 5(1.905,2.909) 6(0.635,2.909) 7(-0.635,2.909) 8(-1.905,2.909)
  rect 3.3x2.4 smd: 9(0,0)
HDR-TH_6P-P2.54-V-F
  rect 1.8x1.6 hole 1.02: 1(-6.35,0)
  round 1.6 hole 1.02: 2(-3.81,0) 3(-1.27,0) 4(1.27,0) 5(3.81,0) 6(6.35,0)
HDR-TH_8P-P2.54-V-F-1
  rect 1.8x1.8 hole 1.2: 1(-8.89,0)
  round 1.8 hole 1.2: 2(-6.35,0) 3(-3.81,0) 4(-1.27,0) 5(1.27,0) 6(3.81,0) 7(6.35,0) 8(8.89,0)
L1210
  rect 1.474x2.22 smd: 1(-1.703,0) 2(1.703,0)
LED0805-RD
  rect 1x1.25 smd: 1(-1.1,0) 2(1.1,0)
LED-TH_BD5.8-P2.54-RD
  round 1.6 hole 1: 1(1.27,0)
  rect 1.6x1.6 hole 1: 2(-1.27,0)
POWERDI123_L2.8-W1.8-LS3.7-RD
  rect 1.2x1.4 smd: 1(1.375,0)
  rect 2.4x1.4 smd: 2(-1.375,0)
R0805
  rect 1.133x1.377 smd: 1(-1,0) 2(1,0)
RES-ADJ-SMD_3P-L3.0-W3.8-P1.75-BR
  rect 1.2x1.2 smd: 1(1.625,-1) 3(1.625,1)
  rect 1.5x1.6 smd: 2(-1.625,0)
SOT-23-3_L2.9-W1.6-P1.90-LS2.8-BR
  rect 1.07x0.6 smd: 1(1.235,-0.95) 2(1.235,0.95) 3(-1.235,0)
SOT-23-6_L2.9-W1.6-P0.95-LS2.8-BL
  rect 0.532x1.072 hole 0.319: 1(-0.95,-1.149) 3(0.95,-1.149) 5(0,1.149)
  rect 0.532x1.072 smd: 2(0,-1.149) 4(0.95,1.149) 6(-0.95,1.149)
SOT-23-6_L2.9-W1.6-P0.95-LS2.8-BR
  rect 1x0.55 smd: 1(1.4,-0.95) 2(1.4,0) 3(1.4,0.95)
  rect 1x0.55 hole 0.6: 4(-1.4,0.95) 5(-1.4,0) 6(-1.4,-0.95)
SOT-23_L2.9-W1.3-P1.90-LS2.4-BR
  rect 1x0.8 smd: 1(1.15,-0.95) 2(1.15,0.95)
  rect 1x0.8 hole 0.6: 3(-1.15,0)
SOT-89-3_L4.5-W2.5-P1.50-LS4.2-BR
  rect 1.575x0.672 smd: 1(1.356,-1.5) 3(1.356,1.5)
  custom 0x0 smd: 2(-1.356,0)
SW-TH_BTSA-X-P-11
  round 1.6 hole 1: 1(-2.5,2) 2(-2.5,-2) 3(2.5,2) 4(2.5,-2)
SW-TH_SK12D07VG4
  round 1.524 hole 0.914: 1(-2,0) 2(0,0) 3(2,0)
  oval 1.4x2.2 hole 0.8x1.6: 4(4.15,0) 5(-4.15,0)
USB-C-TH_TYPEC-306DDW-ARP16
  oval 1.3x3.2 hole 0.7x2: 17(4.32,1.825) 20(-4.32,1.825)
  oval 1.3x2.8 hole 0.7x1.6: 18(4.32,-2.325) 19(-4.32,-2.325)
  round 0.65 hole 0.4: A1(-2.975,2.325) A4(-2.125,2.325) A5(-1.275,2.325) A6(-0.425,2.325) A7(0.425,2.325) A8(1.275,2.325) A9(2.125,2.325) A12(2.975,2.325) B1(2.975,0.975) B4(2.125,0.975) B5(1.275,0.975) B6(0.425,0.975) B7(-0.425,0.975) B8(-1.275,0.975) B9(-2.125,0.975) B12(-2.975,0.975)

## Nets
5V: C2.2 ESP1.1 U3.2
GND: C1.1 C2.1 C3.1 C5.2 ESP1.2 ESP2.5 Q1.2 Q2.2 Q3.6 R1.2 R3.2 R7.1 R9.1 R10.1 SOLAR_PIN.2 SW1.2 U1.1 U1.3 U3.1 USB_C.A1 USB_C.A12 USB_C.B1 USB_C.B12
VCC: C5.1 D1.1 L1.2 L2.2 L3.2 L4.2 L5.2 L6.2 L7.2 L8.2 L9.2 L10.2 LED1.2 LED2.2 Q4.1 R7.2 R10.2 SOURCE_SW.2 SW1.3 U1.2 U1.4 U1.8
B+: BT1.1 C3.2 Q4.3 R8.2 U1.5
B-: BT2.1 C4.1 Q3.2 Q3.3 U2.6
FT5V: FT232RL.4 SW1.4
FTGND: ESP2.1 FT232RL.6
IO0: ESP2.6 SW1.1
IO1: ESP1.6 R2.2
IO2: ESP1.3 R4.2
RX: ESP2.2 FT232RL.2
S+: SOLAR_PIN.1 SOURCE_SW.3
TX: ESP2.3 FT232RL.3
USB+: SOURCE_SW.1 USB_C.A4 USB_C.A9 USB_C.B4 USB_C.B9
$1N774: L1.1 L2.1 L3.1 L4.1 L5.1 Q1.3
$1N1189: Q1.1 R1.1 R2.1
$1N3694: L6.1 L7.1 L8.1 L9.1 L10.1 Q2.3
$1N3696: Q2.1 R3.1 R4.1
$1N13989: LED1.1 R5.1
$1N14047: LED2.1 R6.1
$1N15255: R6.2 U1.7
$1N15286: R5.2 U1.6
$1N20138: C4.2 R8.1 U2.5
$1N20626: Q3.4 U2.1
$1N20664: Q3.5 U2.3
$1N21805: R9.2 U2.2
$1N25982: L11.2 U3.3
$1N28786: C1.2 D1.2 L11.1 Q4.2

Pads without a net: ESP1 4 5 7 8; ESP2 4 7 8; FT232RL 1 5; Q3 1; R7 3; SOURCE_SW 4 5; U1 9; U2 4; USB_C 17 18 19 20 A5 A6 A7 A8 B5 B6 B7 B8

## Via types
v1: diameter 0.61, hole 0.305, Top Layer to Bottom Layer, 4 vias
v2: diameter 0.7, hole 0.305, Top Layer to Bottom Layer, 2 vias

## Routing (per net, layer and track width the routed paths; a pad name or vN(x,y) marks a point on that pad's centre or on a via; arc(x,y) is an arc through that point)
5V: length 83.1
  Top Layer w0.7: U3.2 71.93,13.42 60.54,13.42 v2(60.5,13.38)
  Bottom Layer w0.7: v2(60.5,13.38) 53.76,6.65 40.43,6.65 36.49,10.58 36.49,20.74 47.14,31.39 57.43,31.39 ESP1.1
GND: length 21.8
  Bottom Layer w0.5: Q3.6 88.82,54.46 88.82,50.84 87.98,50.01 USB_C.B1 ; SOLAR_PIN.2 13.73,55.26 SW1.2
  Bottom Layer w0.7: C2.1 75.72,23.94 74.24,25.41 C5.2
VCC: length 224.5
  Top Layer w0.254: D1.1 55.69,26.67 57.05,28.03 R10.2 60.3,30.4 Q4.1 72.24,30.84 L8.2 76.24,29.51 C5.1
  Top Layer w0.7: 46.91,16.17 52.24,16.17 53.52,17.45 60.51,17.45 L7.2 67.69,21.89 70.3,24.49 75.91,24.49 76.24,24.82 ; 46.91,16.17 SOURCE_SW.2 ; 46.91,16.17 39.41,16.17 L5.2 29.38,16.81 L4.2 19.22,21.63 L3.2 16.93,34.33 L2.2 20.87,51.61 L1.2 11.47,60.75 SW1.3 ; 84.88,40.94 84.12,40.18 84.12,39.4 ; 84.88,40.94 85.01,41.06 86.53,41.06 87.67,39.92 87.67,34.73 86.53,33.58 ; 84.88,40.94 84.75,41.06 82.34,41.06 81.58,40.3 U1.4 76.88,44.1 L9.2 75.35,45.26 73.83,46.78 L10.2 ; 86.53,33.58 LED2.2 86.61,30.09 LED1.2 86.61,25.53 84.56,23.48 83.08,23.48 ; 86.53,33.58 U1.8 ; 76.24,24.82 C5.1 ; 76.24,24.82 81.73,24.82 83.08,23.48 ; 83.08,23.48 R7.2
B+: length 126.5
  Top Layer w0.254: BT1.1 25.43,74.46 BT1.1 ; 25.43,74.46 25.43,71.97
  Top Layer w0.5: U1.5 72.01,43.15 v2(68.24,43.15) ; R8.2 82.32,63.92 C3.2
  Bottom Layer w0.5: 25.43,71.97 33.47,63.92 C3.2 v2(68.24,43.15) 68.24,35.09 Q4.3
B-: length 30.8
  Top Layer w0.254: BT2.1 76.17,74.34
  Top Layer w0.5: Q3.2 Q3.3 89.88,58.1 86.44,58.1 ; 86.44,58.1 86.44,56.53 U2.6 ; 86.44,58.1 86.44,58.46 84.06,60.84 84.06,62.6 85.23,63.77 C4.1 76.17,73.23 76.17,74.34
FT5V: length 52.8
  Bottom Layer w0.7: 48.3,86.4 44.87,82.97 19.98,82.97 13.76,76.75 13.76,62.52 SW1.4
FTGND: length 61.2
  Top Layer w0.254: FT232RL.6 53.38,65.8 47.83,60.24 41.95,60.24 40.78,59.07 40.78,56.3 42.3,54.78 57.7,54.78 ESP2.1
IO0: length 42.9
  Top Layer w0.254: v1(17.3,58.83) 11.07,58.83 SW1.1
  Bottom Layer w0.254: v1(17.3,58.83) 21.95,54.17 44.39,54.17 ESP2.6
IO1: length 4
  Top Layer w0.254: R2.2 ESP1.6
IO2: length 6.6
  Top Layer w0.254: ESP1.3 56.05,39.18 R4.2
RX: length 47.5
  Top Layer w0.254: FT232RL.2 48.11,91.29 53.58,91.29 58.14,86.72 58.14,58.66 ESP2.2
S+: length 69.7
  Top Layer w0.7: SOLAR_PIN.1 8.04,27.22 25.19,10.08 30.78,10.08 37,3.85 39.03,3.85 41.97,0.91 47.24,0.91 SOURCE_SW.3
TX: length 42.2
  Top Layer w0.254: FT232RL.3 45.76,86.73 49.41,90.38 52.45,90.38 56.05,86.78 ESP2.3
USB+: length 79.6
  Top Layer w0.5: SOURCE_SW.1 44.91,8.52 v1(44.87,8.55) ; USB_C.A4 USB_C.B9 88.55,44.91 90.67,47.03 88.55,49.16 USB_C.B4 USB_C.A9
  Bottom Layer w0.5: USB_C.A4 83.52,44.91 80.18,41.57 80.18,35.22 73.4,28.44 60.07,28.44 44.87,13.25 v1(44.87,8.55)
$1N774: length 116.6
  Top Layer w0.254: 30.09,36.87 30.09,26.37 ; 30.09,36.87 L3.1 ; 30.09,36.87 30.09,54.51 20.87,63.73 ; 30.09,26.37 30.09,24.17 ; 30.09,26.37 Q1.3 ; L5.1 34.92,19.35 30.09,24.17 ; 30.09,24.17 L4.1 ; L2.1 10.87,56.27 9.07,56.27 6.64,58.7 6.64,61.3 9.07,63.73 20.87,63.73 ; 20.87,63.73 L1.1
$1N1189: length 6.6
  Top Layer w0.254: Q1.1 48.14,28.84 R2.1 R1.1
$1N3694: length 104.8
  Top Layer w0.254: 68.31,34.71 66.46,36.56 66.46,48.27 ; 68.31,34.71 66.17,32.58 55.12,32.58 52.24,29.7 52.24,24.43 ; 68.31,34.71 L8.1 ; 66.46,48.27 66.46,54.15 L10.1 76.88,58.46 L9.1 ; 66.46,48.27 Q2.3 ; L6.1 52.24,24.43 ; 52.24,24.43 L7.1
$1N3696: length 7.4
  Top Layer w0.25: R3.1 R4.1 53.45,43.78 Q2.1
$1N13989: length 2.8
  Top Layer w0.254: LED1.1 81.81,26.59 R5.1
$1N14047: length 2.7
  Top Layer w0.254: LED2.1 81.84,30.18 R6.1
$1N15255: length 11.6
  Top Layer w0.254: R6.2 81.64,28.38 84.26,28.38 85.43,29.55 85.43,31.24 84.12,32.55 84.12,33.58
$1N15286: length 11.3
  Top Layer w0.254: R5.2 77.76,28.64 77.76,30.39 79.36,31.99 82.03,31.99 82.85,32.81 U1.6
$1N20138: length 17.1
  Top Layer w0.254: C4.2 88.56,61.77 91.58,58.75 91.58,55.13 89.58,53.13 86.15,53.13
$1N25982: length 5.5
  Top Layer w0.254: U3.3 69.83,17.91 L11.2
$1N28786: length 36.1
  Top Layer w0.254: Q4.2 60.74,27.08 v1(60.39,26.74) 59.86,26.21 D1.2 ; v1(65.97,16.72) 65.23,16.72 L11.1 58.53,15.68 56.49,13.64 58.53,11.6 C1.2
  Bottom Layer w0.254: v1(60.39,26.74) 60.39,22.29 v1(65.97,16.72)

## Copper pours and planes (outline as drawn; the poured copper is in the pictures)
GND on Top Layer: outline of 216 points within 0,0.13 93.81,93.94
B+ on Top Layer: 15.64,80.46 27.63,80.46 27.63,68.47 15.64,68.47
B- on Top Layer: 66.4,80.49 78.72,80.49 78.72,68.18 66.4,68.18

## Text on the board
Top Silkscreen Layer: Programar / No Programar | RX | TX | 5V | GND | Designed in Paraguay to track Arboviruses / More info to: github.com/a-bobadilla | USB | SUN | B+ | B- | S- | S+ | JLCJLCJLCJLC
